# Altium schematic sheet Pag4_Processador.SchDoc
size A4
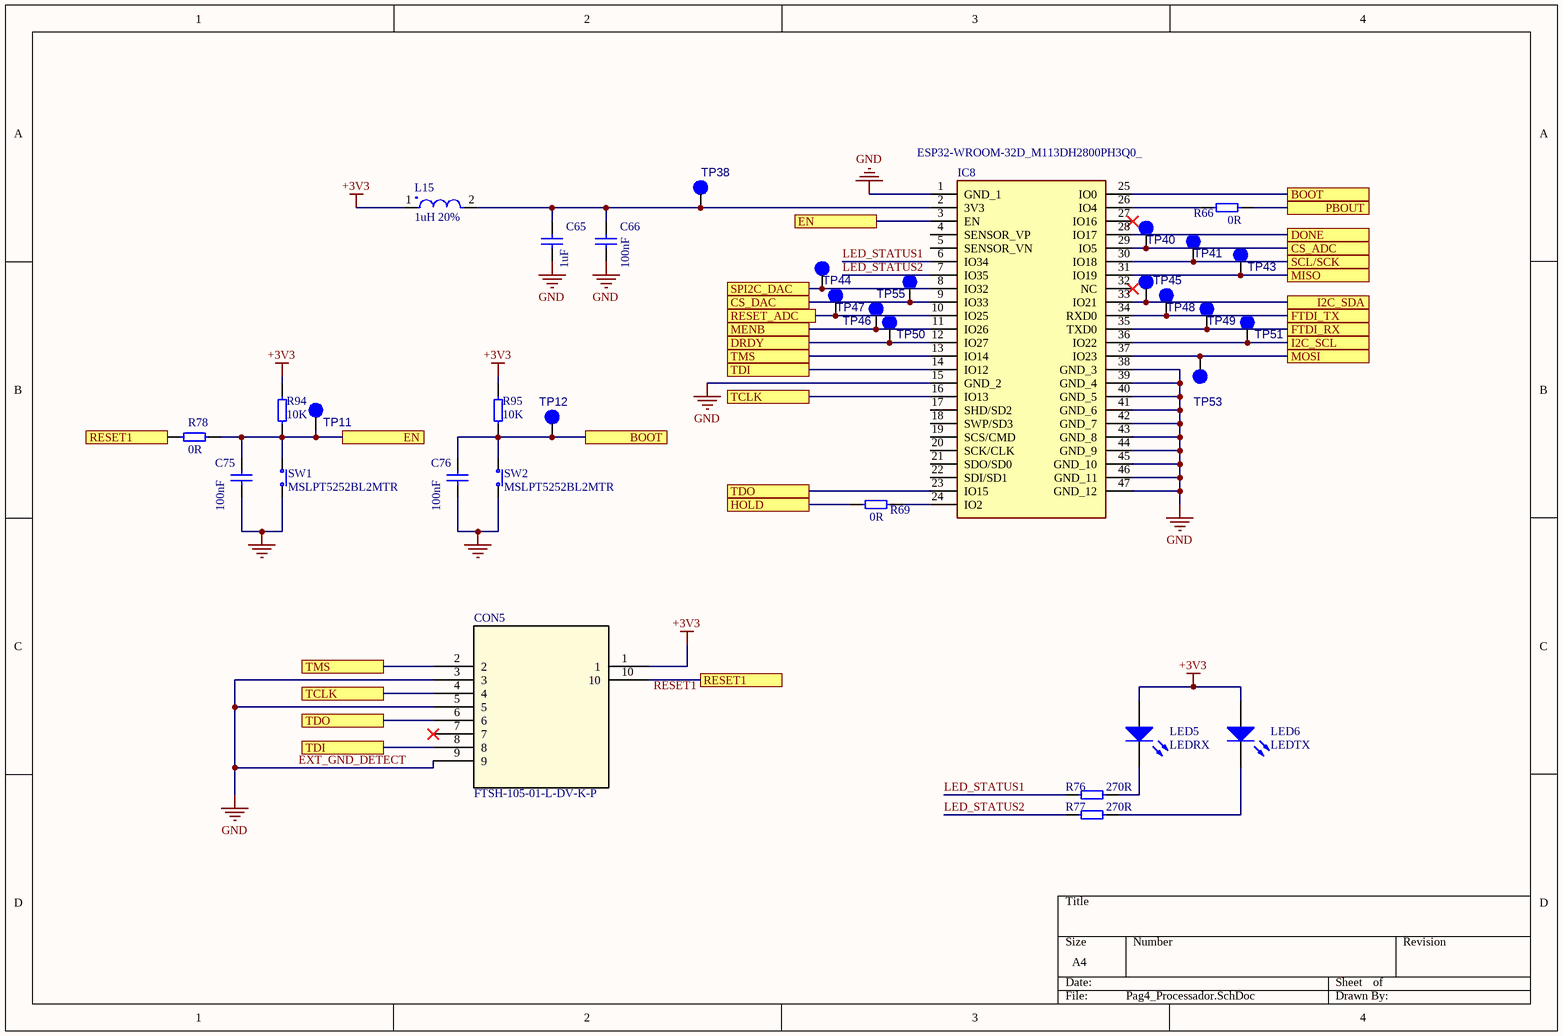
[diagram p0: Pag4_Processador.SchDoc]

## Parts
C65  1uF  [0603]
C66  100nF  [0603]
C75  100nF  [0603]
C76  100nF  [0603]
CON5  FTSH-105-01-L-DV-K-P  [SAMTEC_FTSH-105-XX-X-DV]
IC8  ESP32-WROOM-32D_M113DH2800PH3Q0_  [ESP32WROOM32DM113DH2800PH3Q0]
L15  1uH 20%  [SRP4020-1R5M]
LED5  LEDRX  [0603 - LED]
LED6  LEDTX  [0603 - LED]
R66  0R  [0603]
R69  0R  [0603]
R76  270R  [0603_2]
R77  270R  [0603_2]
R78  0R  [0603]
R94  10K  [0603]
R95  10K  [0603]
SW1  MSLPT5252BL2MTR  [MSLPT5252BG1MTR_pullup]
SW2  MSLPT5252BL2MTR  [MSLPT5252BG1MTR_pullup]
TP11  Test Point  [TEST]  (value not drawn)
TP12  Test Point  [TEST]  (value not drawn)
TP38  Test Point  [TEST]  (value not drawn)
TP40  Test Point  [TEST]  (value not drawn)
TP41  Test Point  [TEST]  (value not drawn)
TP43  Test Point  [TEST]  (value not drawn)
TP44  Test Point  [TEST]  (value not drawn)
TP45  Test Point  [TEST]  (value not drawn)
TP46  Test Point  [TEST]  (value not drawn)
TP47  Test Point  [TEST]  (value not drawn)
TP48  Test Point  [TEST]  (value not drawn)
TP49  Test Point  [TEST]  (value not drawn)
TP50  Test Point  [TEST]  (value not drawn)
TP51  Test Point  [TEST]  (value not drawn)
TP53  Test Point  [TEST]  (value not drawn)
TP55  Test Point  [TEST]  (value not drawn)

## Ports
BOOT, CS_ADC, CS_DAC, DONE, DRDY, EN, FTDI_RX, FTDI_TX, HOLD, I2C_SCL, I2C_SDA, MENB, MISO, MOSI, PBOUT, RESET1, RESET_ADC, SCL/SCK, SPI2C_DAC, TCLK, TDI, TDO, TMS

## Nets
+3V3: CON5.1 L15.1 LED5.1(A) LED6.1(A) R94.2 R95.2
EXT_GND_DETECT: C65.1 C66.1 C75.1 C76.1 CON5.3 CON5.5 CON5.9 IC8.1(GND_1) IC8.15(GND_2) IC8.38(GND_3) IC8.39(GND_4) IC8.40(GND_5) IC8.41(GND_6) IC8.42(GND_7) IC8.43(GND_8) IC8.44(GND_9) IC8.45(GND_10) IC8.46(GND_11) IC8.47(GND_12) SW1.1(N.O) SW2.1(N.O)  [also labelled GND]
BOOT: C76.2 IC8.25(IO0) R95.1 SW2.2(COM) TP12.1(TP) ; port BOOT
CS_ADC: IC8.29(IO5) TP40.1(TP) ; port CS_ADC
CS_DAC: IC8.9(IO33) TP55.1(TP) ; port CS_DAC
DONE: IC8.28(IO17) ; port DONE
DRDY: IC8.12(IO27) TP50.1(TP) ; port DRDY
EN: C75.2 IC8.3(EN) R78.1 R94.1 SW1.2(COM) TP11.1(TP) ; port EN
FTDI_RX: IC8.35(TXD0) TP49.1(TP) ; port FTDI_RX
FTDI_TX: IC8.34(RXD0) TP48.1(TP) ; port FTDI_TX
HOLD: R69.2 ; port HOLD
I2C_SCL: IC8.36(IO22) TP51.1(TP) ; port I2C_SCL
I2C_SDA: IC8.33(IO21) TP45.1(TP) ; port I2C_SDA
LED_STATUS1: IC8.6(IO34) R76.1
LED_STATUS2: IC8.7(IO35) R77.1
MENB: IC8.11(IO26) TP46.1(TP) ; port MENB
MISO: IC8.31(IO19) TP43.1(TP) ; port MISO
MOSI: IC8.37(IO23) TP53.1(TP) ; port MOSI
PBOUT: R66.1 ; port PBOUT
RESET1: CON5.10 R78.2 ; port RESET1
RESET_ADC: IC8.10(IO25) TP47.1(TP) ; port RESET_ADC
SCL/SCK: IC8.30(IO18) TP41.1(TP) ; port SCL/SCK
SPI2C_DAC: IC8.8(IO32) TP44.1(TP) ; port SPI2C_DAC
TCLK: CON5.4 IC8.16(IO13) ; port TCLK
TDI: CON5.8 IC8.14(IO12) ; port TDI
TDO: CON5.6 IC8.23(IO15) ; port TDO
TMS: CON5.2 IC8.13(IO14) ; port TMS
NetC65_2: C65.2 C66.2 IC8.2(3V3) L15.2 TP38.1(TP)
NetIC8_24: IC8.24(IO2) R69.1
NetIC8_26: IC8.26(IO4) R66.2
NetLED5_2: LED5.2(K) R76.2
NetLED6_2: LED6.2(K) R77.2

Not connected (* = marked no-connect by the designer): CON5 7*; IC8 4(SENSOR_VP) 5(SENSOR_VN) 17(SHD/SD2) 18(SWP/SD3) 19(SCS/CMD) 20(SCK/CLK) 21(SDO/SD0) 22(SDI/SD1) 27(IO16)* 32(NC)*

## Notes on the sheet
- Labels drawn without touching a wire or pin: RESET1

## Library data of the parts
C65 = CAP_1uF: Multilayer Ceramic Capacitors MLCC - SMD/SMT 1uF 25V 0603 10%; Manufacturer: Samsung Electro-Mechanics; MPN: CL10A105KA8NNNC; PCBA: Assembly; Moeda: Dólar; NCM: 85322410; Datasheet: https://www.mouser.com/datasheet/2/585/MLCC-1837944.pdf; Value: 1uF; Link/Contato: https://octopart.com/cl10a105ka8nnnc-samsung-9300957?r=sp; Supplier: Mouser
C66 C75 C76 = Cap_1: Multilayer Ceramic Capacitors MLCC - SMD/SMT 100nF 16V 0603 10%; MPN: C0603C104K4RACTU; Manufacturer: Kemet; PCBA: Assembly; Moeda: Dólar; NCM: 85322410; Value: 100nF; Link/Contato: https://octopart.com/c0603c104k4ractu-kemet-93067?r=sp; Supplier: Mouser
CON5 = FTSH-105-01-L-DV-K-P: No Description Available; Manufacturer: Samtec; MPN: FTSH-105-01-L-DV-K-P-TR; PCBA: Assembly; Moeda: Dólar; NCM: 85366990; Datasheet: https://www.mouser.com/datasheet/2/527/ftsh_smt-1316912.pdf; Value: FTSH-105-01-L-DV-K-P; Link/Contato: https://octopart.com/ftsh-105-01-l-dv-k-p-tr-samtec-7458850?r=sp; Supplier: Mouser
IC8 = ESP32-WROOM-32D_M113DH2800PH3Q0_: Integrated Circuit; Manufacturer: Espressif Systems; MPN: ESP32-WROOM-32D(M113DH2800PH3Q0); PCBA: Assembly; Moeda: Dólar; NCM: 85423120; Observações: Alternativo: ESP32-WROOM-32E-N16; Value: ESP32-WROOM-32D_M113DH2800PH3Q0_; Datasheet: https://www.espressif.com/sites/default/files/documentation/esp32-wroom-32d_esp32-wroom-32u_datasheet_en.pdf; Link/Contato: https://octopart.com/esp32-wroom-32d%28m113dh2800ph3q0%29-espressif+systems-109490844?r=sp; Supplier: Mouser
L15 = IC_1uH: Power Inductors - SMD 1uH 20% SMD 4012 AEC-Q200; Manufacturer: Bourns; MPN: SRP4012TA-1R0M; PCBA: Assembly; Moeda: Dólar; NCM: 85045000; Datasheet: https://www.mouser.com/datasheet/2/54/rp4012ta-1391620.pdf; Value: 1uH 20%; Link/Contato: https://octopart.com/srp4012ta-1r0m-bourns-47284976?r=sp; Supplier: Mouser
LED5 LED6 = LED: Standard LEDs - SMD 0603 SMT CHIP LED 572nm; Manufacturer: ROHM Semiconductor; MPN: SML-D13M8WT86; PCBA: Assembly; Moeda: Dólar; NCM: 85414121; Link/Contato: https://octopart.com/sml-d13m8wt86-rohm-24399183?r=sp; Supplier: Mouser
  LED5: Value: LEDRX
  LED6: Value: LEDTX
R66 R69 R78 = Pullup_Res_0_0603_RES: Thick Film Resistors - SMD 0 Ohms 100 mW 0603 5%; MPN: RC0603JR-070RL; Manufacturer: Yageo; PCBA: DNA; Moeda: Dólar; NCM: 85332120; Datasheet: https://www.mouser.com/datasheet/2/447/PYu-RC_Group_51_RoHS_L_10-1527934.pdf; Value: 0R; Link/Contato: https://octopart.com/rc0603jr-070rl-yageo-1241539?r=sp; Supplier: Mouser
R76 R77 = Res: Thick Film Resistors - SMD 270 Ohms 0603 100mW 1%; Manufacturer: Yageo; MPN: RC0603FR-07270RL; PCBA: Assembly; Moeda: Dólar; NCM: 85332120; Value: 270R; Link/Contato: https://octopart.com/rc0603fr-07270rl-yageo-9288890?r=sp; Supplier: Mouser
R94 R95 = Pullup_Res_100K_0603_RES: Thick Film Resistors - SMD 10 kOhms 100-200 mW 0603 1%; MPN: RC0603FR-1310KL; Manufacturer: Yageo; PCBA: Assembly; Moeda: Dólar; NCM: 85332120; Datasheet: https://www.mouser.com/datasheet/2/427/crcwce3-1223726.pdf; Value: 10K; Link/Contato: https://octopart.com/rc0603fr-1310kl-yageo-11543875?r=sp; Supplier: Mouser
SW1 SW2 = Switch-PB-6.2x6.3mm-SMD: Tactile Switch, SPNO, SMD, 160gf, 6.2x6.3x2.5mm; Manufacturer: TE Connectivity / Alcoswitch; PCBA: Assembly; Moeda: Dólar; NCM: 85365090; MPN: MSLPT5252BL2MTR; Link/Contato: https://octopart.com/mslpt5252bl2mtr-te+connectivity+%2F+alcoswitch-96493489?r=sp; Supplier: Mouser
  SW1: Value: MSLPT5252BL2MTR
TP11 TP12 TP38 TP40 TP41 TP43-TP51 TP53 TP55 = TESTPOINT: MPN: Test_Point; Manufacturer: DNA; PCBA: DNA; Value: Test Point